# EAGLE design jdm (EAGLE 4.13)
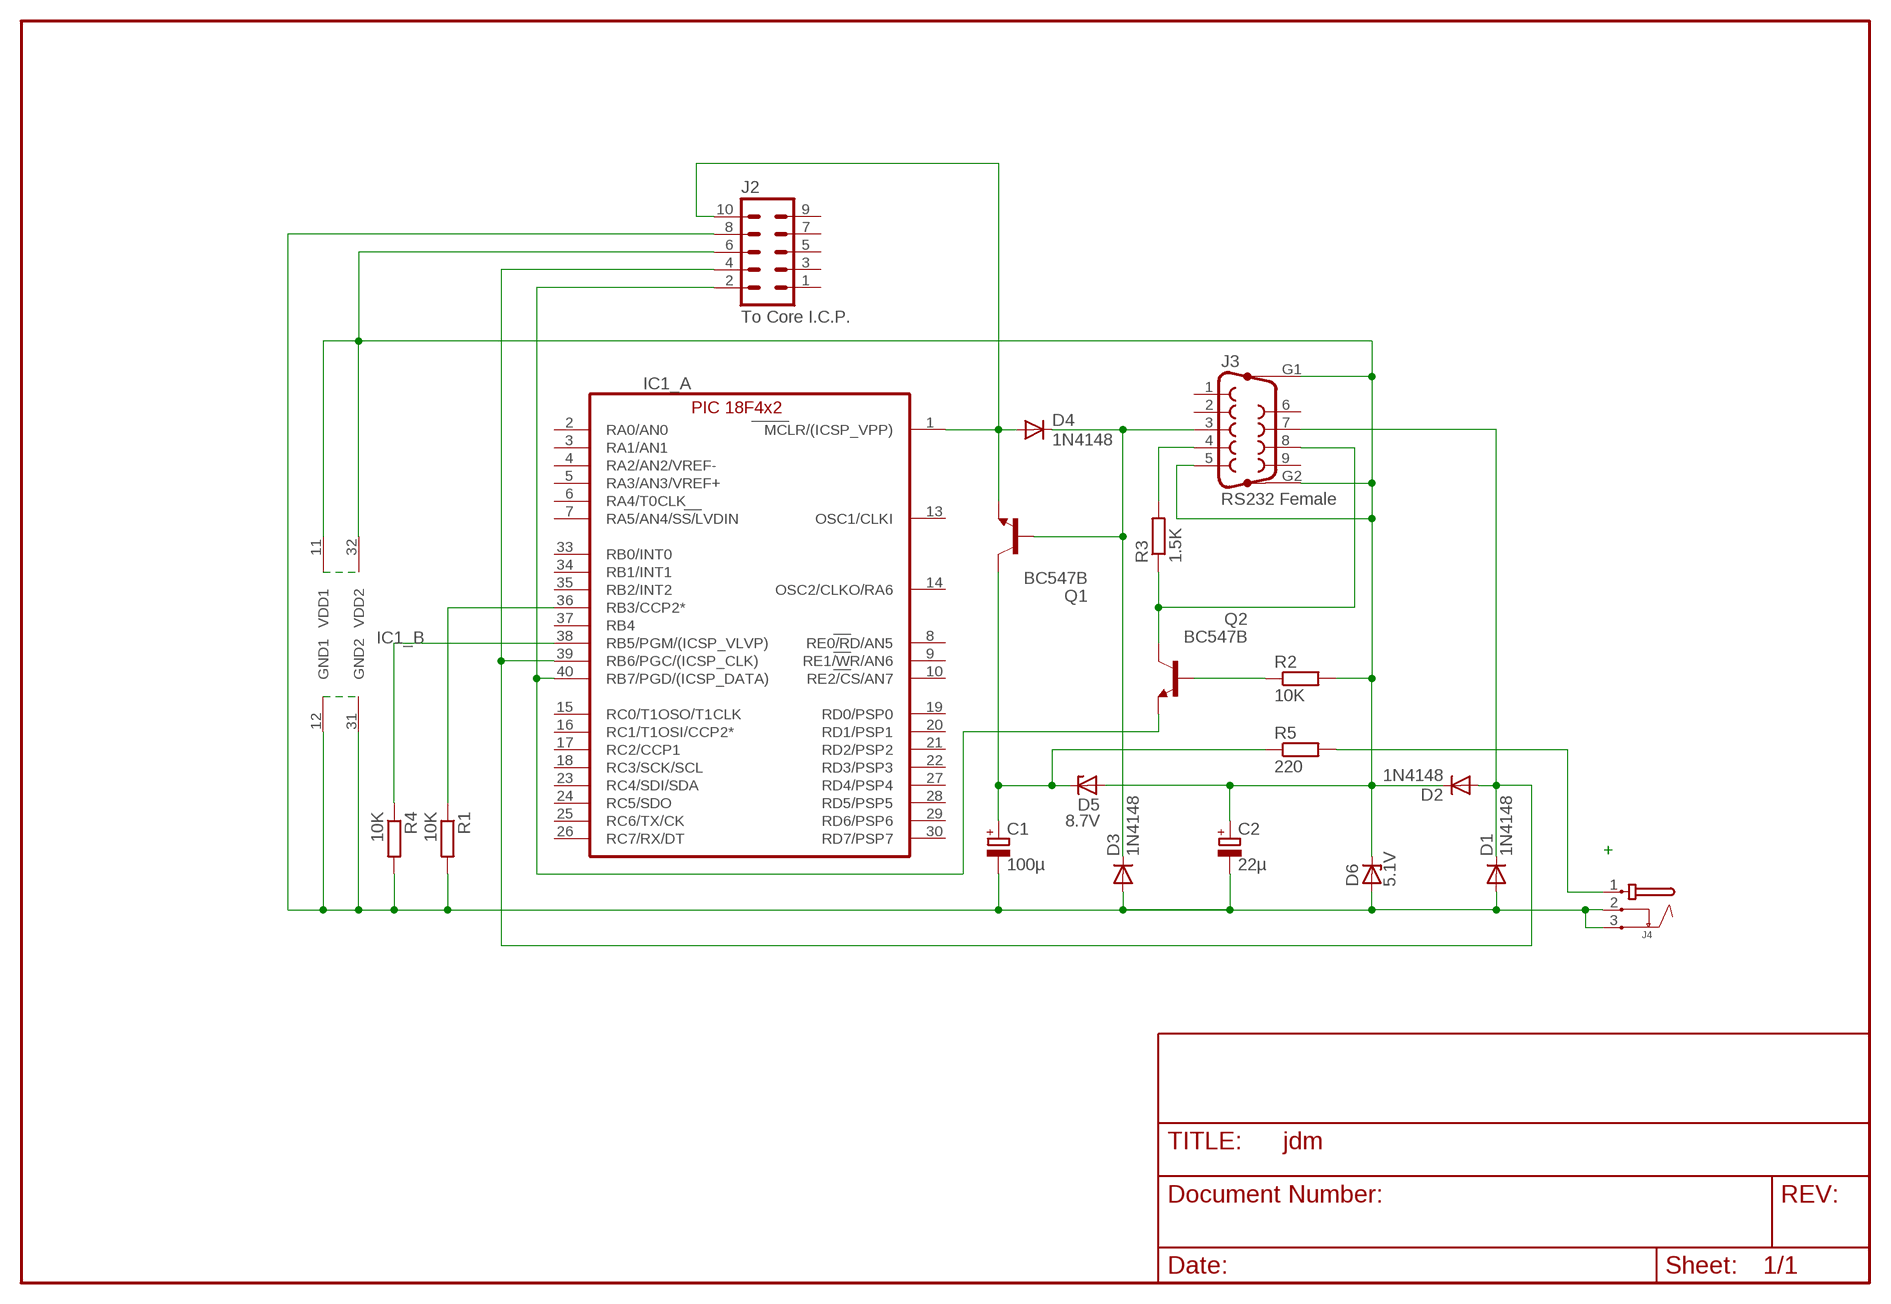
[diagram p0: schematic, sheet 1]

## Parts
C1  100µ  CPOL-EUE2.5-6  [E2,5-6]
C2  22µ  CPOL-EUE2.5-5  [E2,5-5]
D1  1N4148  [DO35-10]
D2  1N4148  [DO35-10]
D3  1N4148  [DO35-10]
D4  1N4148  [DO35-10]
D5  8.7V  ZENER-DIODEDO35Z10  [DO35Z10]
D6  5.1V  ZENER-DIODEDO35Z10  [DO35Z10]
IC1  PIC18F4X2DIL40  [DIL40]
J2  To Core I.C.P.  MA05-2  [MA05-2]
J3  RS232 Female  F09HP  [F09HP]
J4  JACK-PMS  [JACK-PMS]
Q1  BC547B  [TO92]
Q2  BC547B  [TO92]
R1  10K  R-EU_0207/2V  [0207/2V]
R2  10K  R-EU_0207/2V  [0207/2V]
R3  1.5K  R-EU_0207/2V  [0207/2V]
R4  10K  R-EU_0207/7  [0207/7]
R5  220  R-EU_0207/5V  [0207/5V]

## Nets
BQ2: Q2.2(B) R2.1
CTS: J3.8 Q2.3(C) R3.1
DTR: J3.4 R3.2
J1: D1.C D2.A IC1.39(_A:RB6/PGC/(ICSP_CLK)) J2.4 J3.7
MCLR: D4.A IC1.1(_A:MCLR/(ICSP_VPP)) J2.10 Q1.1(E)
N$3: IC1.38(_A:RB5/PGM/(ICSP_VLVP)) R4.1
N$5: J4.1 R5.2
Q1C: C1.+ D5.C Q1.3(C) R5.1
RB3: IC1.36(_A:RB3/CCP2*) R1.1
RB7: IC1.40(_A:RB7/PGD/(ICSP_DATA)) J2.2 Q2.1(E)
TXD: D3.C D4.C J3.3 Q1.2(B)
VDD: C2.+ D2.C D5.A D6.C IC1.11(_B:VDD1) IC1.32(_B:VDD2) J2.6 J3.5 J3.G1 J3.G2 R2.2
VSS: C1.- C2.- D1.A D3.A D6.A IC1.12(_B:GND1) IC1.31(_B:GND2) J2.8 J4.2 J4.3 R1.2 R4.2
Unconnected: IC1.2(_A:RA0/AN0) IC1.3(_A:RA1/AN1) IC1.4(_A:RA2/AN2/VREF-) IC1.5(_A:RA3/AN3/VREF+) IC1.6(_A:RA4/T0CLK) IC1.7(_A:RA5/AN4/SS/LVDIN) IC1.8(_A:RE0/RD/AN5) IC1.9(_A:RE1/WR/AN6) IC1.10(_A:RE2/CS/AN7) IC1.15(_A:RC0/T1OSO/T1CLK) IC1.16(_A:RC1/T1OSI/CCP2*) IC1.17(_A:RC2/CCP1) IC1.18(_A:RC3/SCK/SCL) IC1.19(_A:RD0/PSP0) IC1.20(_A:RD1/PSP1) IC1.21(_A:RD2/PSP2) IC1.22(_A:RD3/PSP3) IC1.23(_A:RC4/SDI/SDA) IC1.24(_A:RC5/SDO) IC1.25(_A:RC6/TX/CK) IC1.26(_A:RC7/RX/DT) IC1.27(_A:RD4/PSP4) IC1.28(_A:RD5/PSP5) IC1.29(_A:RD6/PSP6) IC1.30(_A:RD7/PSP7) IC1.33(_A:RB0/INT0) IC1.34(_A:RB1/INT1) IC1.35(_A:RB2/INT2) IC1.37(_A:RB4) J2.1 J2.3 J2.5 J2.7 J2.9 J3.1 J3.2 J3.6 J3.9

## Notes on the sheet
- +

## Power pins joined to a net without a drawn wire
OSC1/CLKI: IC1.13(_A:OSC1/CLKI)
OSC2/CLKO/RA6: IC1.14(_A:OSC2/CLKO/RA6)

## Library data of the parts
C1 C2 = rcl:CPOL-EU: POLARIZED CAPACITOR, European symbol
D1-D4 = diode:1N4148: DIODE high speed (Philips)
D5 D6 = diode:ZENER-DIODE: Z-Diode
IC1 = pic18f4x2:PIC18F4X2: Pic Microcontroller
J2 = con-lstb:MA05-2: PIN HEADER
J3 = con-subd:F09HP: SUB-D
J4 = POWER-IN:JACK-PMS
Q1 Q2 = transistor-npn:BC547*: NPN Transistor
R1-R5 = rcl:R-EU_: RESISTOR, European symbol

## Board
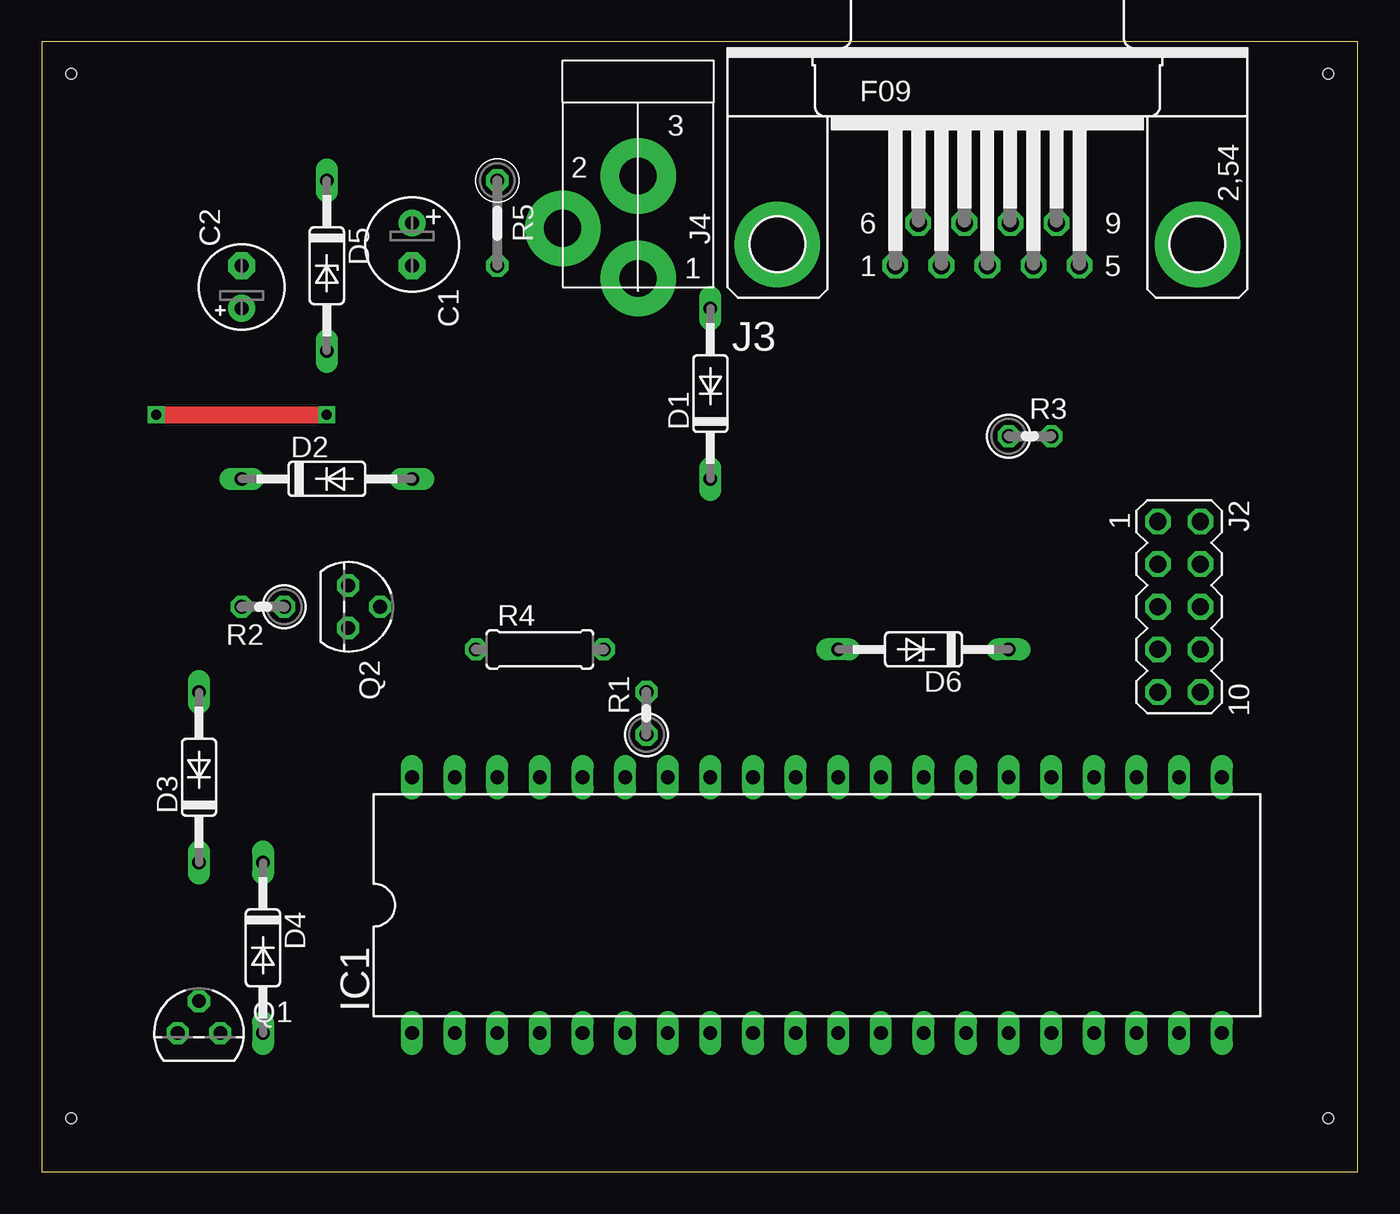
[diagram p1: board, top side]
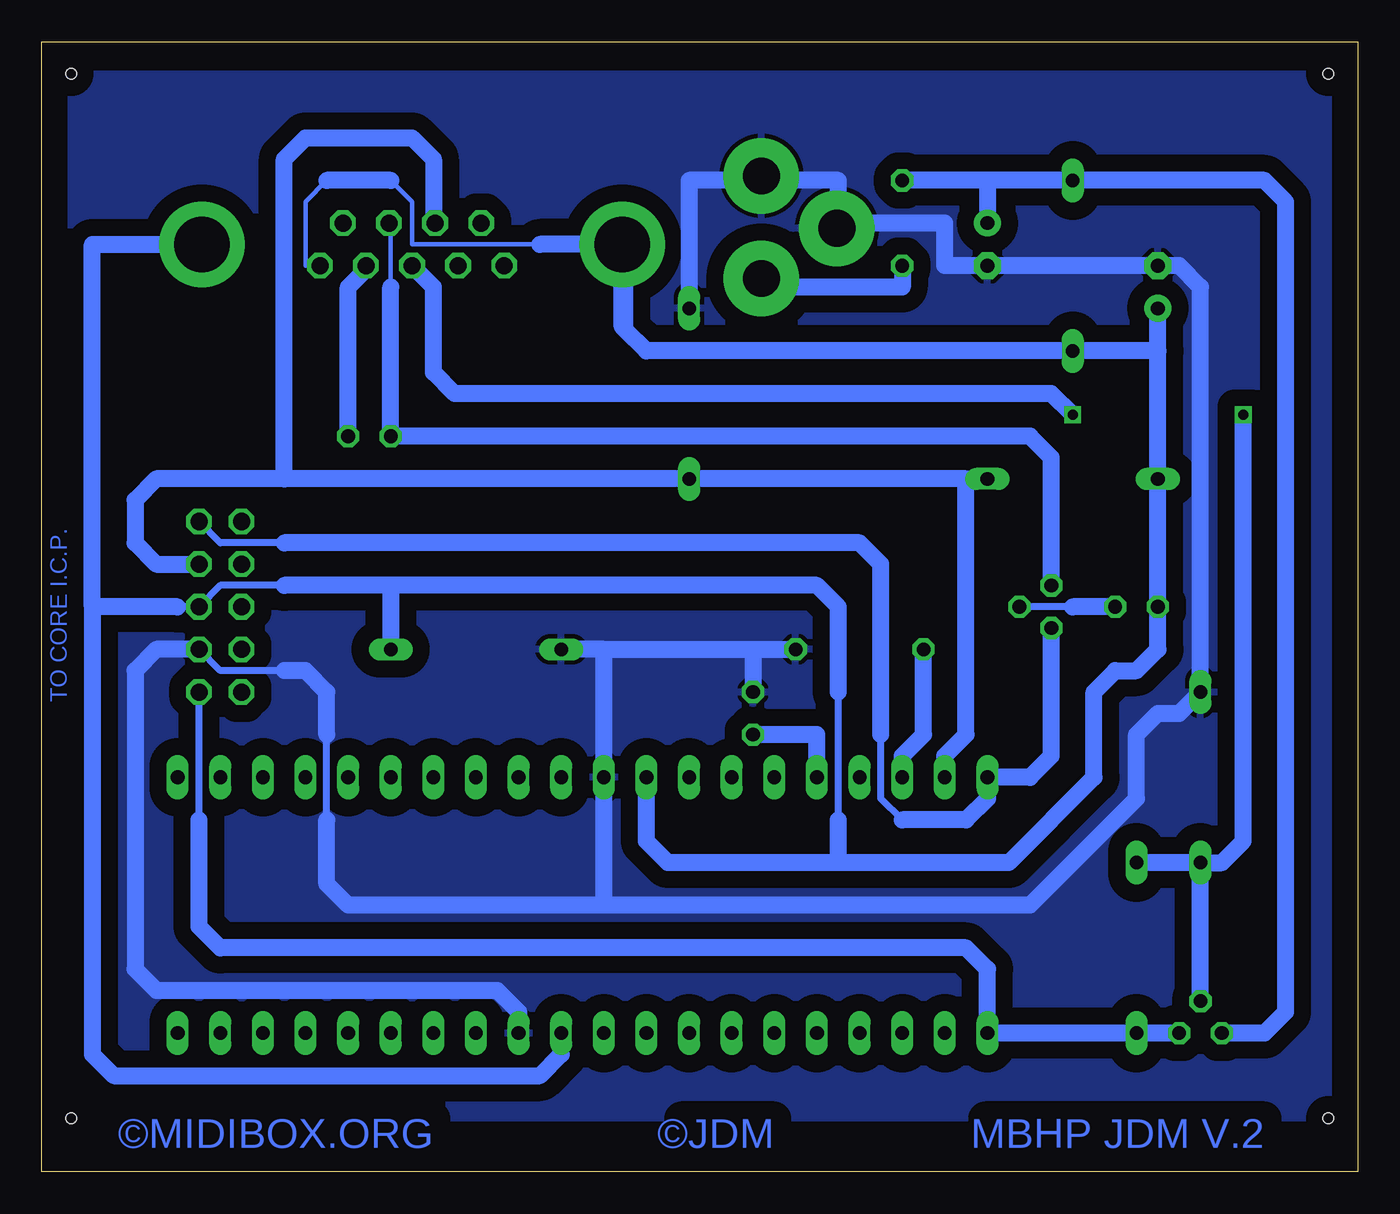
[diagram p2: board, bottom side, seen from below]

Size 78.41 x 67.3 mm. Coordinates in mm from the lower left corner, seen from the top.
Outline: 78.41,67.3 0,67.3 0,0 78.41,0 78.41,67.3
Copper layers (1*16): Top 0.035mm / dielectric 1.5mm / Bottom 0.035mm
Design rules "default": minimum track width 10mil, minimum drill 24mil, track to track 8mil, track to pad 8mil, pad to pad 8mil, via to via 8mil, smd to smd 8mil, copper to edge 40mil, drill to drill 8mil, minimum pad ring 10mil, minimum via ring 8mil, stop-mask expansion 4mil, vias tented up to drill 0mil, thermal gap 10mil
Holes 0.6 mm at 76.67,3.17 76.67,65.4 1.74,3.17 1.74,65.4

### Footprints (pad centres in the part's own frame; a part is rotated, then mirrored left to right if it is on the bottom)
E2,5-6 = drill 0.813 pad 1.6 round: + -1.27,0 | drill 0.813 pad 1.6 octagon: - 1.27,0
E2,5-5 = drill 0.813 pad 1.6 round: + -1.27,0 | drill 0.813 pad 1.6 octagon: - 1.27,0
DO35-10 = drill 0.813 long: A 5.08,0; C -5.08,0
DO35Z10 = drill 0.813 long: A 5.08,0; C -5.08,0
DIL40 = drill 0.813 long: 1 -24.13,-7.62; 2 -21.59,-7.62; 3 -19.05,-7.62; 4 -16.51,-7.62; 5 -13.97,-7.62; 6 -11.43,-7.62; 7 -8.89,-7.62; 8 -6.35,-7.62; 9 -3.81,-7.62; 10 -1.27,-7.62; 11 1.27,-7.62; 12 3.81,-7.62; 13 6.35,-7.62; 14 8.89,-7.62; 15 11.43,-7.62; 16 13.97,-7.62; 17 16.51,-7.62; 18 19.05,-7.62; 19 21.59,-7.62; 20 24.13,-7.62; 21 24.13,7.62; 22 21.59,7.62; 23 19.05,7.62; 24 16.51,7.62; 25 13.97,7.62; 26 11.43,7.62; 27 8.89,7.62; 28 6.35,7.62; 29 3.81,7.62; 30 1.27,7.62; 31 -1.27,7.62; 32 -3.81,7.62; 33 -6.35,7.62; 34 -8.89,7.62; 35 -11.43,7.62; 36 -13.97,7.62; 37 -16.51,7.62; 38 -19.05,7.62; 39 -21.59,7.62; 40 -24.13,7.62
MA05-2 = drill 1.016 octagon: 1 -5.08,-1.27; 2 -5.08,1.27; 3 -2.54,-1.27; 4 -2.54,1.27; 5 0,-1.27; 6 0,1.27; 7 2.54,-1.27; 8 2.54,1.27; 9 5.08,-1.27; 10 5.08,1.27
F09HP = drill 1.016 octagon: 1 -5.486,-1.27; 2 -2.743,-1.27; 3 0,-1.27; 4 2.743,-1.27; 5 5.486,-1.27; 6 -4.115,1.27; 7 -1.372,1.27; 8 1.372,1.27; 9 4.115,1.27 | drill 3.302 pad 5.08 round: G1 -12.522,0; G2 12.522,0
JACK-PMS = drill 2.184 pad 4.5 round: 1 -0.5,-3.31; 2 -5,-0.31; 3 -0.5,2.809
TO92 = drill 0.813 octagon: 1 1.27,0; 2 0,1.905; 3 -1.27,0
0207/2V = drill 0.813 octagon: 1 -1.27,0; 2 1.27,0
0207/7 = drill 0.813 octagon: 1 -3.81,0; 2 3.81,0
0207/5V = drill 0.813 octagon: 1 -2.54,0; 2 2.54,0

### Placement (x,y rotation side)
C1  22.06,55.24 270 top
C2  11.9,52.7 90 top
D1  39.84,46.35 90 top
D2  16.98,41.27 0 top
D3  9.36,23.49 90 top
D4  13.17,13.33 270 top
D5  16.98,53.97 270 top
D6  52.54,31.11 180 top
IC1  46.19,15.87 0 top
J2  67.78,33.65 270 top
J3  56.35,55.24 0 top
J4  36.03,56.51 0 top
Q1  9.36,8.25 0 top
Q2  18.25,33.65 270 top
R1  36.03,27.3 90 top
R2  13.17,33.65 180 top
R3  58.89,43.81 0 top
R4  29.68,31.11 0 top
R5  27.14,56.51 270 top

### Tracks (layer width: path | path; a pad name or v marks a point on that pad's centre or on a via)
BQ2
  Bottom 0.254: 19.52,33.65 Q2.2
  Bottom 0.406: 16.98,33.65 19.52,33.65
  Bottom 1.016: R2.1 16.98,33.65
CTS
  Bottom 0.254: J3.8 57.62,56.51 57.62,52.7
  Bottom 1.016: Q2.3 18.25,42.54 19.52,43.81 R3.1 57.62,52.7
DTR
  Bottom 0.254: 58.89,53.97 J3.4
  Bottom 1.016: R3.2 60.16,52.7 58.89,53.97
J1
  Bottom 0.254: 55.08,56.51 J3.7
  Bottom 1.016: 63.97,41.27 D1.C 23.33,41.27 | 63.97,41.27 63.97,60.32 62.7,61.59 56.35,61.59 55.08,60.32 55.08,56.51 | IC1.39 24.6,24.76 23.33,26.03 23.33,41.27 | J2.4 71.59,36.19 72.86,37.46 72.86,40 71.59,41.27 63.97,41.27 | 23.33,41.27 D2.A
MCLR
  Bottom 0.406: 69.05,20.95 J2.10
  Bottom 1.016: 69.05,20.95 69.05,14.6 67.78,13.33 23.33,13.33 22.06,12.06 IC1.1 D4.A Q1.1
N$3
  Bottom 1.016: R4.1 25.87,26.03 27.14,24.76 IC1.38
N$5
  Bottom 0.406: J4.1 36.03,53.2 36.03,52.7
  Bottom 1.016: R5.2 27.14,52.7 36.03,52.7
Q1C
  Bottom 1.016: 22.06,59.05 R5.1 | Q1.3 5.55,8.25 4.28,9.52 4.28,57.78 5.55,59.05 D5.C 22.06,59.05 | 22.06,59.05 C1.+
RB3
  Bottom 1.016: IC1.36 32.22,26.03 R1.1
RB7
  Bottom 0.406: 63.97,37.46 67.78,37.46 J2.2 | 27.14,20.95 28.41,22.22 28.41,26.03
  Bottom 1.016: 28.41,26.03 28.41,36.19 29.68,37.46 63.97,37.46 | 27.14,20.95 23.33,20.95 22.06,22.22 IC1.40 19.52,23.49 18.25,24.76 Q2.1
TXD  (via drill 0.6)
  Top 1.016: v6.82,45.08 v16.98,45.08
  Bottom 1.016: D3.C 8.09,18.41 6.82,19.68 v6.82,45.08 | v16.98,45.08 18.25,46.35 53.81,46.35 55.08,47.62 55.08,52.7 J3.3 | D3.C D4.C | Q1.2 D3.C
VDD
  Bottom 0.254: R2.2 D2.C | 61.43,59.05 62.7,57.78 62.7,53.97 J3.5 61.43,53.97 | 57.62,59.05 56.35,57.78 56.35,55.24 48.73,55.24 44.92,55.24
  Bottom 0.406: 70.32,33.65 J2.6 67.78,34.92 63.97,34.92 | 30.95,20.95 30.95,28.57
  Bottom 1.016: 11.9,48.89 D2.C R2.2 11.9,31.11 13.17,29.84 14.44,29.84 15.71,28.57 15.71,23.49 20.79,18.41 30.95,18.41 | 11.9,48.89 C2.+ | 30.95,18.41 41.11,18.41 42.38,19.68 IC1.32 | 30.95,18.41 30.95,20.95 | 57.62,34.92 D6.C | IC1.11 47.46,6.98 48.73,5.71 74.13,5.71 75.4,6.98 75.4,31.11 75.4,32.38 75.4,33.65 | 70.32,33.65 75.4,33.65 | J3.G1 43.65,55.24 43.65,50.16 | 57.62,34.92 32.22,34.92 30.95,33.65 30.95,28.57 | 57.62,34.92 63.97,34.92 | J3.G1 43.83,50.34 43.65,50.16 | 43.65,50.16 42.38,48.89 D5.A 11.9,48.89 | J3.G1 44.92,55.24 | J3.G1 48.73,55.24 | 57.62,59.05 61.43,59.05 | J3.G2 75.4,55.24 75.4,33.65
VSS
  Bottom 0.254: C2.- C1.- | 44.92,22.22 IC1.31 | 36.03,59.05 J4.3
  Bottom 0.406: 44.92,15.87 60.16,15.87 | 61.43,20.95 61.43,26.03 | 63.97,29.84 67.78,29.84 J2.8 | 30.95,56.51 30.95,56.2 J4.2
  Bottom 1.016: 43.65,15.87 44.92,15.87 44.92,22.22 44.92,26.03 | IC1.31 44.92,26.03 | 44.92,26.03 44.92,31.11 | 44.92,31.11 D6.A | 44.92,31.11 36.03,31.11 | 63.97,29.84 62.7,29.84 61.43,28.57 61.43,26.03 | 61.43,20.95 61.43,17.14 60.16,15.87 43.65,15.87 | IC1.12 50,9.52 51.27,10.79 71.59,10.79 72.86,12.06 72.86,29.84 71.59,31.11 J2.8 | 43.65,15.87 19.52,15.87 13.17,22.22 13.17,26.03 11.9,27.3 10.63,27.3 D3.A 9.36,52.7 10.63,53.97 C2.- C1.- 24.6,53.97 24.6,56.51 30.95,56.51 30.95,59.05 36.03,59.05 39.84,59.05 D1.A | 36.03,31.11 R1.2 | 36.03,31.11 R4.2
  pour Bottom (isolate 1.016): 1.74,65.4 1.74,3.17 76.67,3.17 76.67,65.4

### Text on the board
Bottom: TO CORE I.C.P. | MBHP JDM V.2 | ©JDM | ©MIDIBOX.ORG